# Altium schematic sheet receiver_am26c32.SchDoc
size A; SheetNumber: 17
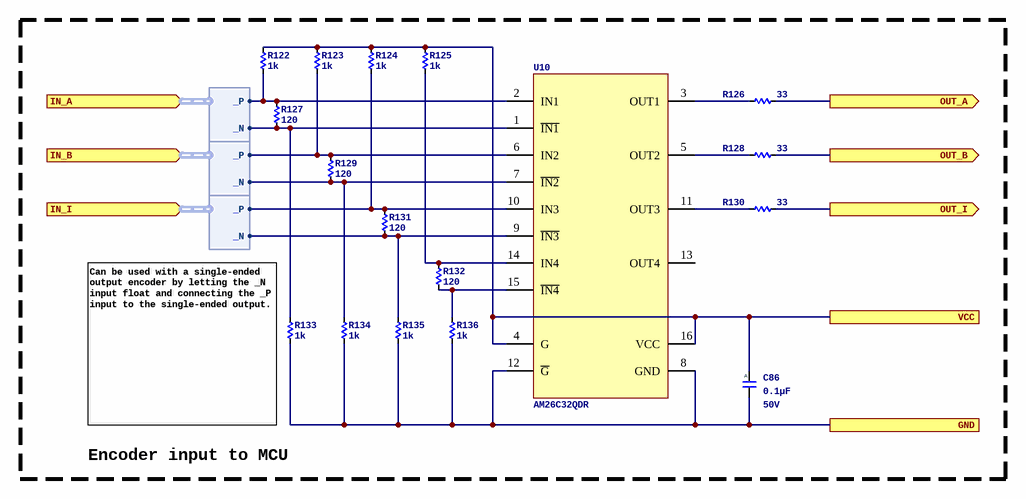
[diagram p0: receiver_am26c32.SchDoc]

## Parts
C86  Capacitance: 0.1µF  Voltage - Rated: 50V  [C0402_0.55MM]  (hidden comment: CGA2B3X7R1H104M050BB)
R122  Resistance: 1k  [R0402_0.40MM]
R123  Resistance: 1k  [R0402_0.40MM]
R124  Resistance: 1k  [R0402_0.40MM]
R125  Resistance: 1k  [R0402_0.40MM]
R126  Resistance: 33  [R0402_0.40MM]  (hidden comment: ERJ-2RKF33R0X)
R127  Resistance: 120  [R0805_0.70MM]  (hidden comment: ERJ-6ENF1200V)
R128  Resistance: 33  [R0402_0.40MM]  (hidden comment: ERJ-2RKF33R0X)
R129  Resistance: 120  [R0805_0.70MM]  (hidden comment: ERJ-6ENF1200V)
R130  Resistance: 33  [R0402_0.40MM]  (hidden comment: ERJ-2RKF33R0X)
R131  Resistance: 120  [R0805_0.70MM]  (hidden comment: ERJ-6ENF1200V)
R132  Resistance: 120  [R0805_0.70MM]  (hidden comment: ERJ-6ENF1200V)
R133  Resistance: 1k  [R0402_0.40MM]
R134  Resistance: 1k  [R0402_0.40MM]
R135  Resistance: 1k  [R0402_0.40MM]
R136  Resistance: 1k  [R0402_0.40MM]
U10  AM26C32QDR  [16SOIC150]

## Blocks framed on the sheet
Encoder input to MCU: C86 R122-R136 U10

## Ports
GND, IN_A (in, harness DIFF), IN_B (in, harness DIFF), IN_I (in, harness DIFF), OUT_A (out), OUT_B (out), OUT_I (out), VCC

## Harnesses
DIFF: _P, _N

## Nets
GND: C86.2 R133.2 R134.2 R135.2 R136.2 U10.8(GND) U10.12(~{G}) ; port GND
OUT_A: R126.1 ; port OUT_A
OUT_B: R128.1 ; port OUT_B
OUT_I: R130.1 ; port OUT_I
VCC: C86.1 R122.1 R123.1 R124.1 R125.1 U10.4(G) U10.16(VCC) ; port VCC
NetR122_2: R122.2 R127.1 U10.2(IN1) ; port IN_A._P
NetR123_2: R123.2 R129.1 U10.6(IN2) ; port IN_B._P
NetR124_2: R124.2 R131.1 U10.10(IN3) ; port IN_I._P
NetR125_2: R125.2 R132.1 U10.14(IN4)
NetR126_2: R126.2 U10.3(OUT1)
NetR127_2: R127.2 R133.1 U10.1(~{IN1}) ; port IN_A._N
NetR128_2: R128.2 U10.5(OUT2)
NetR129_2: R129.2 R134.1 U10.7(~{IN2}) ; port IN_B._N
NetR130_2: R130.2 U10.11(OUT3)
NetR131_2: R131.2 R135.1 U10.9(~{IN3}) ; port IN_I._N
NetR132_2: R132.2 R136.1 U10.15(~{IN4})

Not connected (* = marked no-connect by the designer): U10 13(OUT4)

## Notes on the sheet
- (near R133) Can be used with a single-ended output encoder by letting the _N input float and connecting the _P input to the single-ended output.
- (in symbol CGA2B3X7R1H104M050BB) A

## Library data of the parts
C86 = CGA2B3X7R1H104M050BB: CAP CER 0.1UF 50V X7R 0402; Manufacturer: TDK Corporation; Unit Price (USD): 0.17; Tolerance: ±20%; ComponentLink1URL: https://product.tdk.com/info/en/catalog/datasheets/mlcc_automotive_general_en.pdf?ref_disty=digikey; ComponentLink1Description: Series Datasheet; Series: CGA; Part Status: Active; Temperature Coefficient: X7R; Operating Temperature: -55°C ~ 125°C; Applications: AEC-Q200; Mounting Type: Surface Mount, MLCC; Package / Case: 0402 (1005 Metric); Size / Dimension: 0.039" L x 0.020" W (1.00mm x 0.50mm); Thickness (Max): 0.022" (0.55mm); Supplier 1: Digikey; Supplier Part Number 1: 445-12271-1-ND; Manufacturer Part Number: CGA2B3X7R1H104M050BB
R122-R125 R133-R136 = ERJ-2RKF1001X: RES SMD 1K OHM 1% 1/10W 0402; Manufacturer 1: Panasonic Electronic Components; Unit Price (USD): 0.1; Power (Watts): 0.1W, 1/10W; Temperature Coefficient: ±100ppm/°C; ComponentLink1Description: Datasheet; ComponentLink1URL: https://industrial.panasonic.com/cdbs/www-data/pdf/RDA0000/AOA0000C304.pdf; Series: ERJ; Tolerance: ±1%; Composition: Thick Film; Features: Automotive AEC-Q200; Operating Temperature: -55°C ~ 155°C; Package / Case: 0402 (1005 Metric); Supplier Device Package: 0402; Size / Dimension: 0.039" L x 0.020" W (1.00mm x 0.50mm); Height - Seated (Max): 0.016" (0.40mm); Manufacturer Part Number 1: ERJ-2RKF1001X; Supplier 1: Digikey; Supplier Part Number 1: P1.00KLCT-ND
R126 R128 R130 = ERJ-2RKF33R0X: RES SMD 33 OHM 1% 1/10W 0402; Manufacturer: Panasonic Electronic Components; Unit Price (USD): 0.1; Power (Watts): 0.1W, 1/10W; Temperature Coefficient: ±100ppm/°C; ComponentLink1Description: Datasheet; ComponentLink1URL: https://industrial.panasonic.com/cdbs/www-data/pdf/RDA0000/AOA0000C304.pdf; Series: ERJ; Tolerance: ±1%; Composition: Thick Film; Features: Automotive AEC-Q200; Operating Temperature: -55°C ~ 155°C; Package / Case: 0402 (1005 Metric); Supplier Device Package: 0402; Size / Dimension: 0.039" L x 0.020" W (1.00mm x 0.50mm); Height - Seated (Max): 0.016" (0.40mm); Supplier 1: Digikey; Supplier Part Number 1: P33.0LCT-ND; Manufacturer Part Number: ERJ-2RKF33R0X
R127 R129 R131 R132 = ERJ-6ENF1200V: RES SMD 120 OHM 1% 1/8W 0805; Manufacturer: Panasonic Electronic Components; Unit Price (USD): 0.1; Power (Watts): 0.125W, 1/8W; Temperature Coefficient: ±100ppm/°C; ComponentLink1Description: Datasheet; ComponentLink1URL: https://industrial.panasonic.com/cdbs/www-data/pdf/RDA0000/AOA0000C304.pdf; Series: ERJ; Tolerance: ±1%; Composition: Thick Film; Features: Automotive AEC-Q200; Operating Temperature: -55°C ~ 155°C; Package / Case: 0805 (2012 Metric); Supplier Device Package: 0805; Size / Dimension: 0.079" L x 0.049" W (2.00mm x 1.25mm); Height - Seated (Max): 0.028" (0.70mm); Supplier 1: Digikey; Supplier Part Number 1: P120CCT-ND; Manufacturer Part Number: ERJ-6ENF1200V
U10 = RS422_AM26C32QDR: Quadruple Differential Line Receiver 16-SOIC -40 to 125; Manufacturer: Texas Instruments; Supplier 1: Digikey; Supplier Part Number 1: 296-47737-1-ND; Manufacturer Part Number: AM26C32QDR; ComponentLink1URL: https://www.ti.com/lit/ds/symlink/am26c32.pdf; ComponentLink1Description: Datasheet; Supplier 2: LCSC; Supplier Part Number 2: C544587